# EAGLE design mini_breakout_with_chip_100kx2 (EAGLE 7.5.0)
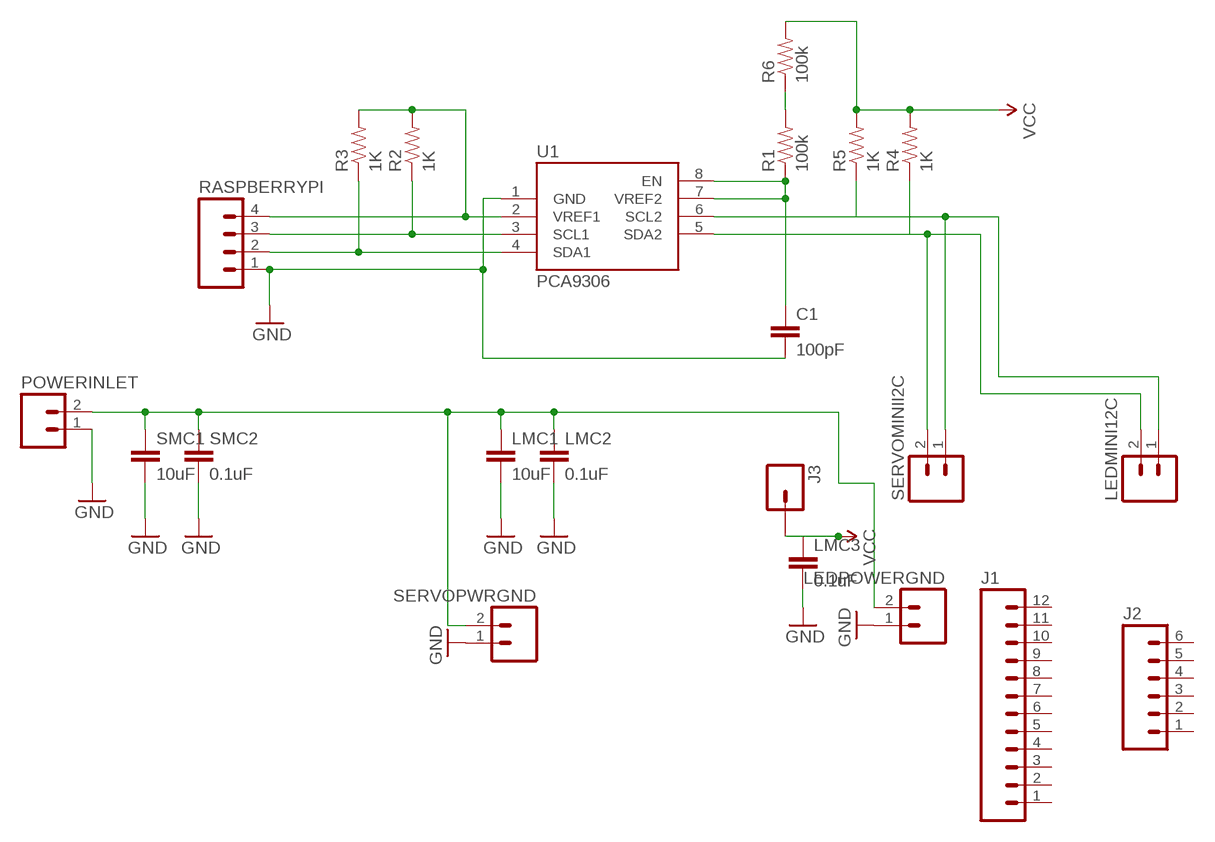
[diagram p0: schematic, sheet 1]

## Parts
C1  100pF  100PF-50V-5%(0603)  [0603-CAP]
J1  M121X12_NO_SILK_KIT  [1X12_NO_SILK_KIT]
J2  M06NO_SILK_YES_STOP  [1X06_NO_SILK_YES_STOP]
J3  M01NOSILK-KIT  [1X01NS-KIT]
LEDMINI12C  M02PTH  [1X02]
LEDPOWERGND  M021X02_NO_SILK  [1X02_NO_SILK]
LMC1  10uF  10UF-6.3V-20%(0603)  [0603-CAP]
LMC2  0.1uF  0.1UF-25V-5%(0603)  [0603-CAP]
LMC3  0.1uF  0.1UF-25V-5%(0603)  [0603-CAP]
POWERINLET  M02PTH  [1X02]
R1  100k  100KOHM-1/10W-1%(0603)  [0603-RES]
R2  1K  1KOHM-1/10W-1%(0603)  [0603-RES]
R3  1K  1KOHM-1/10W-1%(0603)  [0603-RES]
R4  1K  1KOHM-1/10W-1%(0603)  [0603-RES]
R5  1K  1KOHM-1/10W-1%(0603)  [0603-RES]
R6  100k  100KOHM-1/10W-1%(0603)  [0603-RES]
RASPBERRYPI  M04PTH  [1X04]
SERVOMINII2C  M02PTH  [1X02]
SERVOPWRGND  M021X02_NO_SILK  [1X02_NO_SILK]
SMC1  10uF  10UF-6.3V-20%(0603)  [0603-CAP]
SMC2  0.1uF  0.1UF-25V-5%(0603)  [0603-CAP]
U1  PCA9306  [PSOP-8]

## Nets
GND: C1.2 LEDPOWERGND.1 LMC1.2 LMC2.2 LMC3.2 POWERINLET.1 RASPBERRYPI.1 SERVOPWRGND.1 SMC1.2 SMC2.2 U1.1(GND)
N$1: R2.2 R3.2 RASPBERRYPI.4 U1.2(VREF1)
N$2: R2.1 RASPBERRYPI.3 U1.3(SCL1)
N$3: R3.1 RASPBERRYPI.2 U1.4(SDA1)
N$4: LEDPOWERGND.2 LMC1.1 LMC2.1 POWERINLET.2 SERVOPWRGND.2 SMC1.1 SMC2.1
N$5: C1.1 R1.1 U1.7(VREF2) U1.8(EN)
N$6: LEDMINI12C.1 R5.1 SERVOMINII2C.1 U1.6(SCL2)
N$7: LEDMINI12C.2 R4.1 SERVOMINII2C.2 U1.5(SDA2)
N$8: R1.2 R6.1
VCC: J3.1 LMC3.1 R4.2 R5.2 R6.2
Unconnected: J1.1 J1.2 J1.3 J1.4 J1.5 J1.6 J1.7 J1.8 J1.9 J1.10 J1.11 J1.12 J2.1 J2.2 J2.3 J2.4 J2.5 J2.6

## Library data of the parts
C1 = SparkFun-Capacitors:100PF-50V-5%(0603): CAP-07883; PROD_ID: CAP-07883
J1 = SparkFun-Connectors:M12: Header 12 Standard 12-pin 0.1" header. Use with straight break away headers (SKU : PRT-00116), right angle break away headers (PRT-00553), swiss pins (PRT-00743), machine pins (PRT-00117), and female headers (PRT-00115).
J2 = SparkFun-Connectors:M06: Header 6 Standard 6-pin 0.1" header. Use with straight break away headers (SKU : PRT-00116), right angle break away headers (PRT-00553), swiss pins (PRT-00743), machine pins (PRT-00117), and female headers (PRT-00115). Molex polarized connector foot print use with SKU : PRT-08094 with associated crimp pins and housings. NOTES ON THE VARIANTS LOCK and LOCK_LONGPADS... This footprint was designed to help hold the alignment of a through-hole component (i.e. 6-pin header) while soldering it into place. You may notice that each hole has been shifted either up or down by 0.005 of an inch from it's more standard position (which is a perfectly straight line). This slight alteration caused the pins (the squares in the middle) to touch the edges of the holes. Because they are alternating, it causes a "brace" to hold the component in place. 0.005 has proven to be the perfect amount of "off-center" position when using our standard breakaway headers. Although looks a little odd when you look at the bare footprint, once you have a header in there, the alteration is very hard to notice. Also,if you push a header all the way into place, it is covered up entirely on the bottom side. This idea of altering the position of holes to aid alignment will be further integrated into the Sparkfun Library for other footprints. It can help hold any component with 3 or more connection pins.
J3 = SparkFun-Connectors:M01: Header 1 Standard 1-pin 0.1" header. Use with straight break away headers (SKU : PRT-00116), right angle break away headers (PRT-00553), swiss pins (PRT-00743), machine pins (PRT-00117), and female headers (PRT-00115). SMTSO-256-ET is a "flush mount" nut for a 4-40 screw. The older package used to be too tight, and did not allow it to sit properly thru the drill hit. The latest (0.165DIA) fits nice and snug.
LEDMINI12C LEDPOWERGND POWERINLET SERVOMINII2C SERVOPWRGND = SparkFun-Connectors:M02: Standard 2-pin 0.1" header. Use with - straight break away headers ( PRT-00116) - right angle break away headers (PRT-00553) - swiss pins (PRT-00743) - machine pins (PRT-00117) - female headers (PRT-00115) Molex polarized connector foot print use with: PRT-08233 with associated crimp pins and housings. 2.54_SCREWTERM for use with PRT-10571. 3.5mm Screw Terminal footprints for PRT-08084 5mm Screw Terminal footprints for use with PRT-08432
LMC1 SMC1 = SparkFun-Capacitors:10UF-6.3V-20%(0603): CAP-11015; PROD_ID: CAP-11015
LMC2 LMC3 SMC2 = SparkFun-Capacitors:0.1UF-25V-5%(0603): CAP-08604; PROD_ID: CAP-08604
R1 R6 = SparkFun-Resistors:100KOHM-1/10W-1%(0603): RES-07828; PROD_ID: RES-07828
R2-R5 = SparkFun-Resistors:1KOHM-1/10W-1%(0603): RES-07856; PROD_ID: RES-07856
RASPBERRYPI = SparkFun-Connectors:M04: Header 4 Standard 4-pin 0.1" header. Use with straight break away headers (SKU : PRT-00116), right angle break away headers (PRT-00553), swiss pins (PRT-00743), machine pins (PRT-00117), and female headers (PRT-00115). Molex polarized connector foot print use with SKU : PRT-08231 with associated crimp pins and housings. 1MM SMD Version SKU: PRT-10208; PROD_ID: CONN-09696
U1 = new-pca9306:PCA9306: Bidirectional I2C level shifter. NOT compatible with all available part number pinout schemes- DOUBLE CHECK!!!; PROD_ID: IC-10023

## Board
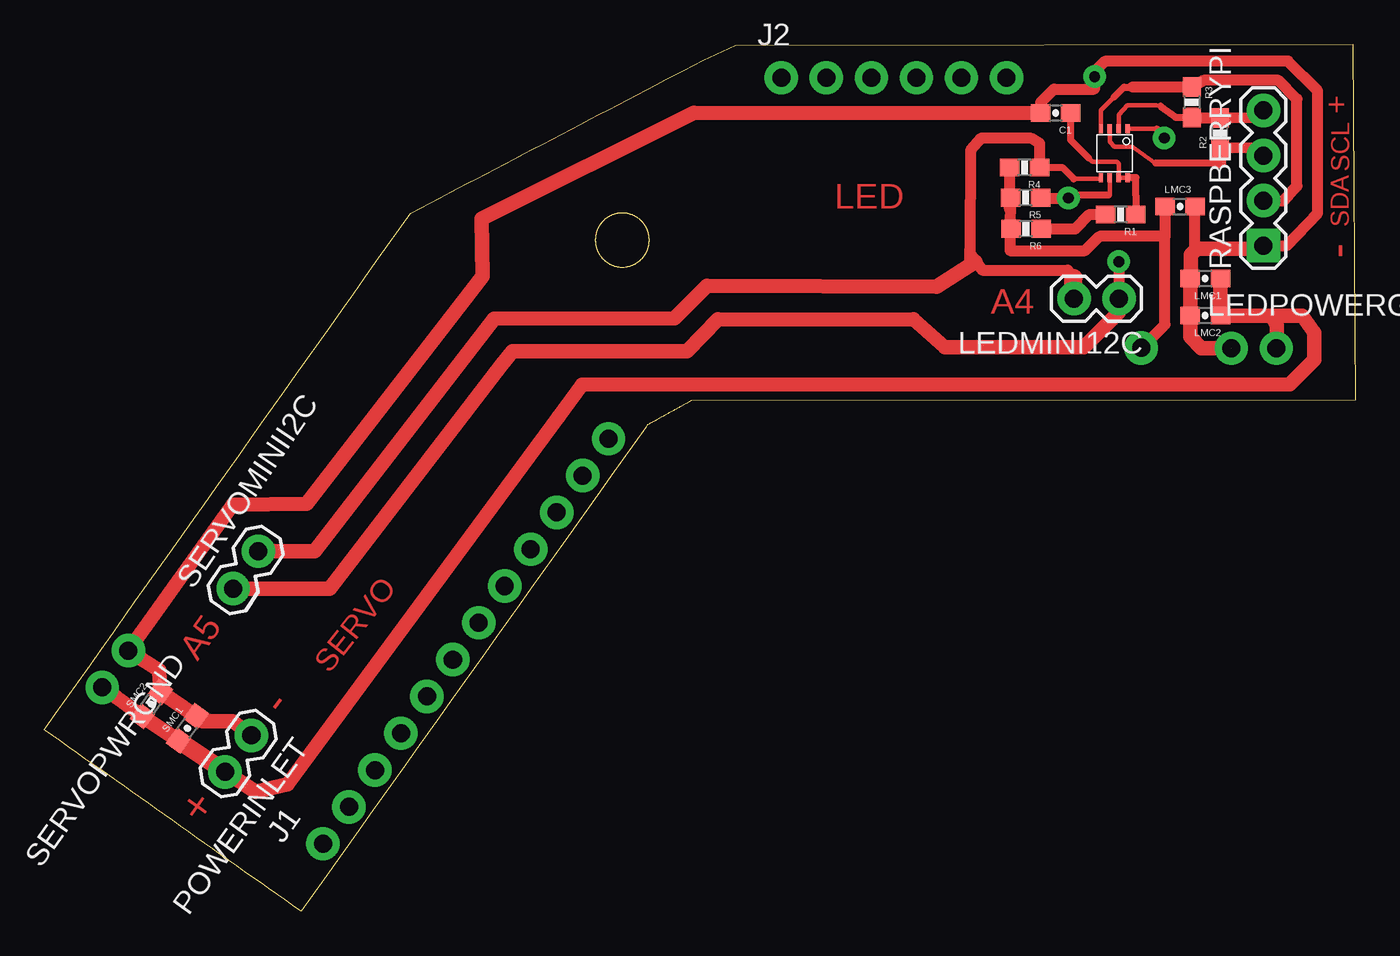
[diagram p1: board, top side]
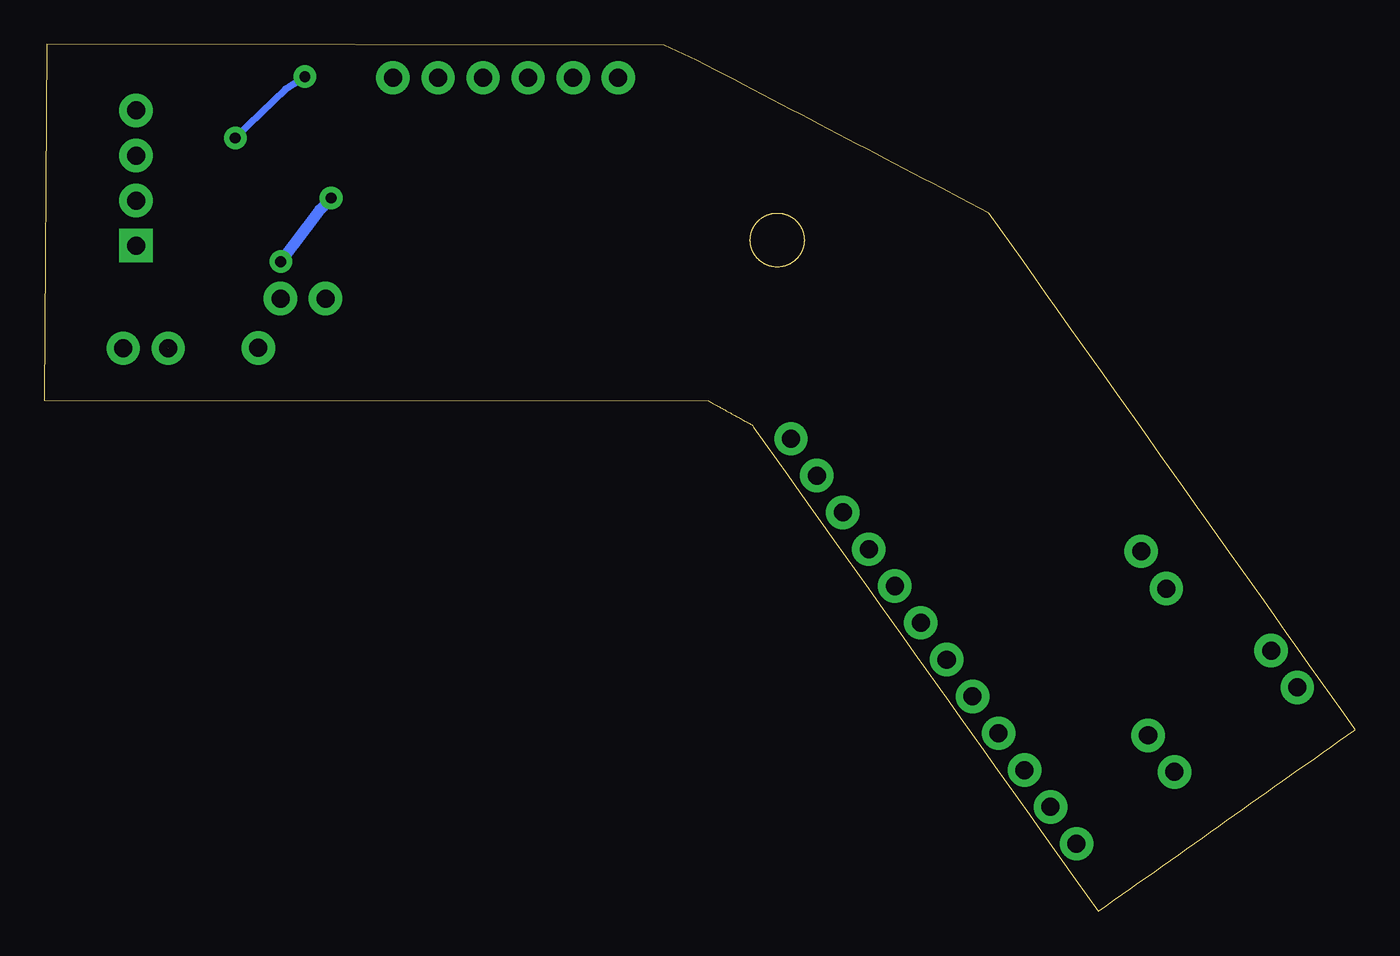
[diagram p2: board, bottom side, seen from below]

Size 73.93 x 48.88 mm. Coordinates in mm from the lower left corner, seen from the top.
Outline: 32.62,39.37 32.57,39.37 32.54,39.37 32.52,39.37 32.49,39.37 32.47,39.36 32.41,39.36 32.39,39.36 32.36,39.35 32.34,39.35 32.31,39.34 32.29,39.34 32.26,39.33 32.24,39.33 32.22,39.32 32.19,39.32 32.17,39.31 32.12,39.29 32.1,39.29 32.07,39.28 32.05,39.27 32.03,39.26 32,39.25 31.98,39.24 31.96,39.23 31.94,39.22 31.91,39.21 31.89,39.2 31.87,39.19 31.85,39.17 31.83,39.16 31.78,39.14 31.76,39.12 31.74,39.11 31.72,39.1 31.7,39.08 31.68,39.07 31.66,39.05 31.65,39.04 31.61,39.01 31.59,38.99 31.57,38.97 31.55,38.96 31.54,38.94 31.52,38.92 31.5,38.91 31.48,38.89 31.47,38.87 31.45,38.85 31.44,38.83 31.42,38.82 31.4,38.8 31.39,38.78 31.38,38.76 31.36,38.74 31.35,38.72 31.33,38.7 31.32,38.68 31.31,38.66 31.29,38.64 31.28,38.62 31.27,38.59 31.26,38.57 31.24,38.55 31.23,38.53 31.22,38.51 31.21,38.48 31.2,38.46 31.18,38.42 31.17,38.39 31.16,38.37 31.16,38.35 31.15,38.32 31.13,38.28 31.13,38.25 31.12,38.23 31.11,38.2 31.11,38.18 31.1,38.15 31.1,38.13 31.09,38.1 31.09,38.08 31.09,38.05 31.08,38.03 31.08,37.98 31.08,37.95 31.07,37.92 31.07,37.9 31.07,37.87 31.07,37.82 31.07,37.79 31.07,37.77 31.08,37.74 31.08,37.72 31.08,37.66 31.09,37.64 31.09,37.61 31.09,37.59 31.1,37.56 31.1,37.54 31.11,37.51 31.11,37.49 31.12,37.47 31.13,37.44 31.13,37.42 31.14,37.39 31.15,37.37 31.16,37.35 31.16,37.32 31.17,37.3 31.18,37.28 31.2,37.23 31.21,37.21 31.22,37.19 31.23,37.16 31.24,37.14 31.26,37.12 31.27,37.1 31.28,37.08 31.29,37.06 31.31,37.03 31.32,37.01 31.35,36.97 31.36,36.95 31.39,36.91 31.4,36.9 31.42,36.88 31.44,36.86 31.45,36.84 31.47,36.82 31.48,36.8 31.5,36.79 31.52,36.77 31.54,36.75 31.55,36.73 31.57,36.72 31.59,36.7 31.61,36.69 31.63,36.67 31.65,36.65 31.66,36.64 31.68,36.62 31.7,36.61 31.72,36.6 31.74,36.58 31.76,36.57 31.78,36.56 31.83,36.53 31.85,36.52 31.87,36.51 31.89,36.49 31.91,36.48 31.94,36.47 31.96,36.46 31.98,36.45 32,36.44 32.03,36.43 32.05,36.42 32.07,36.41 32.1,36.41 32.12,36.4 32.17,36.38 32.19,36.38 32.22,36.37 32.24,36.36 32.26,36.36 32.29,36.35 32.31,36.35 32.34,36.34 32.36,36.34 32.39,36.34 32.41,36.33 32.47,36.33 32.49,36.33 32.52,36.32 32.54,36.32 32.57,36.32 32.62,36.32 32.65,36.32 32.67,36.32 32.7,36.33 32.73,36.33 32.78,36.33 32.8,36.34 32.83,36.34 32.85,36.34 32.88,36.35 32.9,36.35 32.93,36.36 32.95,36.36 32.98,36.37 33,36.38 33.03,36.38 33.07,36.4 33.1,36.41 33.12,36.41 33.14,36.42 33.17,36.43 33.19,36.44 33.21,36.45 33.23,36.46 33.26,36.47 33.28,36.48 33.3,36.49 33.32,36.51 33.34,36.52 33.37,36.53 33.41,36.56 33.43,36.57 33.47,36.6 33.49,36.61 33.51,36.62 33.53,36.64 33.55,36.65 33.57,36.67 33.58,36.69 33.6,36.7 33.62,36.72 33.64,36.73 33.66,36.75 33.69,36.79 33.71,36.8 33.72,36.82 33.74,36.84 33.76,36.86 33.77,36.88 33.79,36.9 33.8,36.91 33.83,36.95 33.85,36.97 33.86,36.99 33.87,37.01 33.89,37.03 33.9,37.06 33.91,37.08 33.92,37.1 33.95,37.14 33.96,37.16 33.97,37.19 33.98,37.21 33.99,37.23 34,37.25 34.01,37.28 34.02,37.3 34.03,37.32 34.04,37.35 34.04,37.37 34.05,37.39 34.06,37.42 34.07,37.44 34.07,37.47 34.08,37.49 34.08,37.51 34.09,37.54 34.09,37.56 34.1,37.59 34.1,37.61 34.11,37.64 34.11,37.66 34.12,37.72 34.12,37.74 34.12,37.77 34.12,37.79 34.12,37.82 34.12,37.87 34.12,37.9 34.12,37.92 34.12,37.95 34.12,37.98 34.11,38.03 34.11,38.05 34.1,38.08 34.1,38.1 34.09,38.13 34.09,38.15 34.08,38.18 34.08,38.2 34.07,38.23 34.07,38.25 34.06,38.28 34.05,38.3 34.04,38.32 34.04,38.35 34.03,38.37 34.02,38.39 34.01,38.42 34,38.44 33.99,38.46 33.98,38.48 33.97,38.51 33.96,38.53 33.95,38.55 33.94,38.57 33.92,38.59 33.91,38.62 33.9,38.64 33.89,38.66 33.87,38.68 33.86,38.7 33.85,38.72 33.83,38.74 33.82,38.76 33.8,38.78 33.79,38.8 33.77,38.82 33.76,38.83 33.74,38.85 33.72,38.87 33.71,38.89 33.69,38.91 33.67,38.92 33.66,38.94 33.64,38.96 33.62,38.97 33.6,38.99 33.58,39.01 33.55,39.04 33.53,39.05 33.49,39.08 33.47,39.1 33.43,39.12 33.41,39.14 33.37,39.16 33.34,39.17 33.32,39.19 33.3,39.2 33.28,39.21 33.26,39.22 33.23,39.23 33.21,39.24 33.19,39.25 33.17,39.26 33.14,39.27 33.12,39.28 33.1,39.29 33.07,39.29 33.03,39.31 33,39.32 32.98,39.32 32.95,39.33 32.93,39.33 32.9,39.34 32.88,39.34 32.85,39.35 32.83,39.35 32.8,39.36 32.78,39.36 32.73,39.36 32.7,39.37 32.67,39.37 32.65,39.37 32.62,39.37
Outline: 14.48,0 14.03,0.32 13.57,0.64 13.12,0.96 12.67,1.28 12.22,1.6 11.76,1.92 11.31,2.24 10.86,2.56 10.41,2.88 9.95,3.2 9.5,3.52 9.05,3.84 8.6,4.16 8.14,4.48 7.69,4.8 7.24,5.12 6.79,5.44 6.33,5.76 5.88,6.08 4.98,6.72 4.52,7.04 4.07,7.36 3.17,8 2.71,8.32 2.26,8.64 1.81,8.96 1.36,9.28 0.9,9.6 0.45,9.92 0,10.24 0.65,11.15 1.29,12.06 1.94,12.98 2.58,13.89 3.23,14.8 3.87,15.71 4.52,16.62 5.16,17.53 5.81,18.44 6.46,19.35 7.1,20.26 8.39,22.08 9.04,22.99 9.68,23.9 10.33,24.81 10.97,25.72 11.62,26.63 12.27,27.54 12.91,28.45 13.56,29.36 14.2,30.27 14.85,31.18 15.49,32.09 16.14,33 16.78,33.91 17.43,34.82 18.08,35.73 18.72,36.64 19.37,37.55 20.01,38.46 20.66,39.37 21.19,39.65 21.72,39.93 22.25,40.2 23.32,40.76 23.85,41.04 24.38,41.31 24.91,41.59 25.44,41.87 25.98,42.15 26.51,42.43 27.04,42.7 27.57,42.98 28.1,43.26 28.64,43.54 29.17,43.81 29.7,44.09 30.23,44.37 30.76,44.65 31.29,44.93 31.83,45.2 32.36,45.48 32.89,45.76 33.42,46.04 34.49,46.59 35.02,46.87 36.08,47.43 36.61,47.7 37.14,47.98 38.98,48.84 73.8,48.88 73.93,28.81 36.47,28.78 36.4,28.74 36.32,28.69 36.24,28.65 36.09,28.57 36.01,28.52 35.94,28.48 35.86,28.44 35.78,28.4 35.71,28.35 35.63,28.31 35.55,28.27 35.48,28.23 35.32,28.14 35.25,28.1 35.17,28.06 35.02,27.97 34.86,27.89 34.78,27.85 34.71,27.8 34.63,27.76 34.55,27.72 34.4,27.63 34.32,27.59 34.25,27.55 34.17,27.51 34.09,27.47 34.02,27.42 34,27.4 33.92,27.3 33.28,26.39 31.98,24.57 31.33,23.66 29.39,20.93 28.74,20.02 28.09,19.11 27.44,18.2 26.79,17.29 26.15,16.38 25.5,15.47 24.85,14.56 24.2,13.65 23.55,12.74 22.9,11.83 22.26,10.92 21.61,10.01 20.96,9.1 20.31,8.19 19.66,7.28 19.02,6.37 18.37,5.46 17.72,4.55 15.77,1.82 15.13,0.91 14.48,0
Copper layers (1*16): Top 0.035mm / dielectric 1.5mm / Bottom 0.035mm
Design rules "default": minimum track width 10mil, minimum drill 24mil, track to track 8mil, track to pad 8mil, pad to pad 8mil, via to via 8mil, smd to smd 8mil, copper to edge 40mil, drill to drill 8mil, minimum pad ring 10mil, minimum via ring 8mil, stop-mask expansion 4mil, vias tented up to drill 0mil, thermal gap 10mil

### Footprints (pad centres in the part's own frame; a part is rotated, then mirrored left to right if it is on the bottom)
0603-CAP = smd 1.1 x 1: 1 -0.85,0; 2 0.85,0
1X12_NO_SILK_KIT = drill 1.016 pad 1.88: 1 0,0; 2 2.54,0; 3 5.08,0; 4 7.62,0; 5 10.16,0; 6 12.7,0; 7 15.24,0; 8 17.78,0; 9 20.32,0; 10 22.86,0; 11 25.4,0; 12 27.94,0
1X06_NO_SILK_YES_STOP = drill 1.016 pad 1.88: 1 0,0; 2 2.54,0; 3 5.08,0; 4 7.62,0; 5 10.16,0; 6 12.7,0
1X01NS-KIT = drill 1.016 pad 1.88: 1 0,0
1X02 = drill 1.016 pad 1.88: 1 0,0; 2 2.54,0
1X02_NO_SILK = drill 1.016 pad 1.88: 1 0,0; 2 2.54,0
0603-RES = smd 1.1 x 1: 1 -0.85,0; 2 0.85,0
1X04 = drill 1.016 pad 1.88 square: 1 0,0 | drill 1.016 pad 1.88: 2 2.54,0; 3 5.08,0; 4 7.62,0
PSOP-8 = smd 0.25 x 0.5: 1 -0.73,-1.37; 2 -0.23,-1.37; 3 0.27,-1.37; 4 0.77,-1.37; 5 0.77,1.38; 6 0.27,1.38; 7 -0.23,1.38; 8 -0.73,1.38

### Placement (x,y rotation side)
C1  57.04,45.01 180 top
J1  15.72,3.81 54.8 top
J2  41.57,47 0 top
J3  61.86,31.76 0 top
LEDMINI12C  60.61,34.55 180 top
LEDPOWERGND  66.95,31.75 0 top
LMC1  65.48,35.67 180 top
LMC2  65.48,33.59 180 top
LMC3  64.05,39.73 0 top
POWERINLET  11.68,9.92 234.2 top
R1  60.71,39.29 180 top
R2  66.31,43.88 90 top
R3  64.71,45.62 270 top
R4  55.29,41.94 180 top
R5  55.34,40.23 180 top
R6  55.37,38.48 180 top
RASPBERRYPI  68.76,37.53 90 top
SERVOMINII2C  10.65,18.2 55.9 top
SERVOPWRGND  4.74,14.7 234.6 top
SMC1  8.06,10.32 54.2 top
SMC2  6.03,11.68 53.9 top
U1  60.36,42.74 180 top

### Tracks (layer width: path | path; a pad name or v marks a point on that pad's centre or on a via)
GND  (via drill 0.6 pad 1.27)  (1 unrouted)
  Top 0.254: 62.75,44.12 U1.1
  Top 0.406: 68.75,37.37 RASPBERRYPI.1 | v59.24,47.05 59.21,46.37 | 63.16,43.7 62.75,44.12
  Top 0.61: 65.01,37.37 64.9,37.48 LMC3.2 | RASPBERRYPI.1 70.08,37.53 71.81,39.36 71.81,46.25 70.13,47.93 59.81,47.92 59.23,47.34 59.23,46.39 59.21,46.37 59.2,46.36 56.94,46.36 56.19,45.61 C1.2 | 64.65,35.7 LMC1.2 | v63.17,43.6 63.16,43.7
  Top 0.813: 68.75,37.37 65.01,37.37 64.65,37.01 64.65,35.7 | LEDPOWERGND.1 65.27,31.75 64.63,32.39 LMC2.2 LMC1.2 | POWERINLET.1 10.62,10.71 8.94,10.71 SMC1.2 SMC2.2 6.48,13.6 SERVOPWRGND.1 10.63,22.92 14.79,22.98 24.72,35.8 24.66,39.04 36.64,45.03 C1.2
  Bottom 0.406: v59.24,47.05 60.33,46.35 v63.17,43.6
N$1
  Top 0.254: U1.2 60.59,44.92 61.09,45.43 62.73,45.43 62.95,45.4
  Top 0.406: 62.95,45.4 63.81,44.76 R3.2
  Top 0.61: RASPBERRYPI.4 68.34,44.74 R2.2 64.73,44.72 R3.2
N$2
  Top 0.254: U1.3 60.09,43.38 60.34,43.11 61.36,43.11 62.67,42.19
  Top 0.406: 66.33,42.19 62.67,42.19
  Top 0.61: RASPBERRYPI.3 68.33,43.04 R2.1 66.33,42.19
N$3
  Top 0.254: U1.4 59.59,45.17 60.33,45.91
  Top 0.406: 60.33,45.91 60.9,46.47 61.38,46.47
  Top 0.61: RASPBERRYPI.2 69.91,40.07 70.65,40.9 70.65,45.79 69.6,46.84 65.4,46.84 R3.1 61.38,46.47
N$4
  Top 0.406: LEDPOWERGND.2 69.5,32.37 | SERVOPWRGND.2 4.01,12.1
  Top 0.813: 69.24,33.58 68.97,33.59 LMC2.1 LMC1.1 | 69.24,33.58 69.5,33.06 69.5,32.37 69.5,31.77 | SMC1.1 SMC2.1 4.01,12.1 | POWERINLET.2 11.91,6.75 13.73,7.16 29,27.88 30.32,29.68 70.25,29.72 71.61,31.11 71.62,32.61 70.96,33.58 69.24,33.58
  Top 1.016: POWERINLET.2 SMC1.1
N$5
  Top 0.254: U1.8 U1.7 60.59,42.16 60.49,42.26 59.11,42.26 58.9,42.47
  Top 0.406: R1.1 61.57,40.34 61.57,41.36 U1.8 | 58.9,42.47 57.89,43.48 C1.1
N$6  (via drill 0.6 pad 1.27)
  Top 0.254: 59.7,40.39 60.09,40.4 U1.6
  Top 0.406: R5.1 57.74,40.17 | 57.74,40.17 58.19,40.39 59.7,40.39 60.02,40.39 | 57.74,40.17 56,40.19
  Top 0.61: 16.1,18.2 13.12,18.18 | 60.61,33.78 LEDMINI12C.1 v60.6,36.63 | 48.99,33.37 49.01,33.39 | 56,40.19 56.01,40.21 v57.76,40.21
  Top 0.813: SERVOMINII2C.1 16.1,18.2 25.79,30.8 26.4,31.57 36.25,31.59 37.98,33.39 48.99,33.37 | 49.01,33.39 50.78,31.81 58.64,31.81 60.61,33.78
  Bottom 0.61: v57.76,40.21 58.4,39.54 v60.6,36.63
N$7
  Top 0.254: 58.06,41.3 59.59,41.3 U1.5
  Top 0.406: 56.23,42.12 R4.1 57.42,41.94 58.06,41.3
  Top 0.61: 58.04,35.72 57.71,36.15 52.91,36.15 52.21,37.09 52.21,37.37 | 52.5,36.62 52.21,36.36 52.21,37.36 52.21,37.37 | R4.1 56.13,43.3 55.6,43.6 52.86,43.6 52.23,42.9 52.21,37.37
  Top 0.813: SERVOMINII2C.2 15.25,20.29 25.37,33.42 35.55,33.45 37.38,35.28 50.32,35.22 52.5,36.62
  Top 1.016: LEDMINI12C.2 58.04,35.72
N$8
  Top 0.406: 59.85,39.08 R1.2
  Top 0.61: R6.1 58.14,38.48 58.95,39.29 R1.2
VCC
  Top 0.61: LMC3.1 63.2,38.06 | 63.2,38.06 63.21,33.1 63.13,33.02 J3.1 | R4.2 54.44,39.58 R5.2 54.46,38.36 54.47,37.26 58.7,37.26 59.51,38.05 60.32,38.07 63.2,38.06
  Top 0.813: R6.2 54.46,38.36

### Text on the board
Top: + | SCL | LED | SDA | - | A4 | A5 | SERVO | - | +